# Altium schematic sheet Sheet2.SchDoc
size A4; SheetNumber: 2; SheetTotal: 2
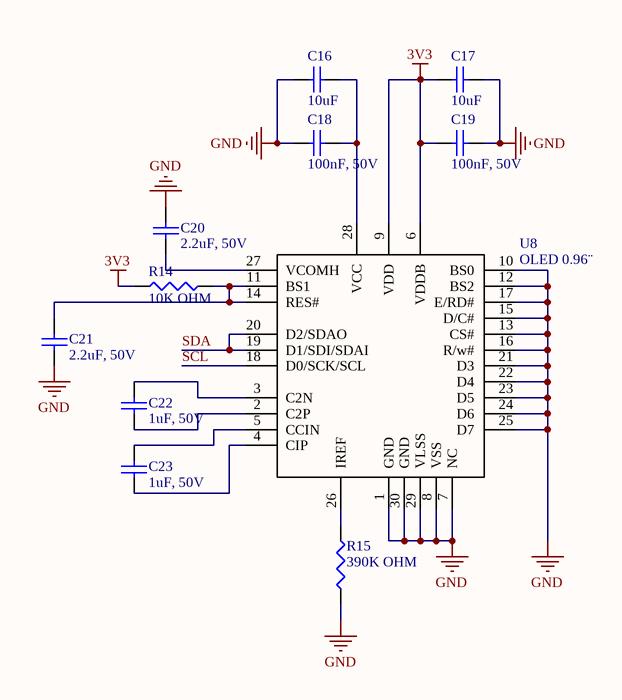
[diagram p0: Sheet2.SchDoc]

## Parts
C16  10uF  [CAP0805]
C17  10uF  [CAP0805]
C18  100nF, 50V  [CAP0805]
C19  100nF, 50V  [CAP0805]
C20  2.2uF, 50V  [CAP0805]
C21  2.2uF, 50V  [CAP0805]
C22  1uF, 50V  [CAP0805]
C23  1uF, 50V  [CAP0805]
R14  10K OHM  [RES 0805]
R15  390K OHM  [RES 0805]
U8  OLED 0.96¨  [OLED_0.96IN_WHITE_SSD1306]

## Nets
3V3: C17.1 C19.1 R14.1 U8.6(VDDB) U8.9(VDD)
GND: C16.1 C17.2 C18.1 C19.2 C20.2 C21.2 R15.2 U8.1(GND) U8.7(NC) U8.8(VSS) U8.10(BS0) U8.12(BS2) U8.13(CS#) U8.15(D/C#) U8.16(R/w#) U8.17(E/RD#) U8.21(D3) U8.22(D4) U8.23(D5) U8.24(D6) U8.25(D7) U8.29(VLSS) U8.30(GND)
SCL: U8.18(D0/SCK/SCL)
SDA: U8.19(D1/SDI/SDAI) U8.20(D2/SDAO)
NetC16_2: C16.2 C18.2 U8.28(VCC)
NetC20_1: C20.1 U8.27(VCOMH)
NetC21_1: C21.1 R14.2 U8.11(BS1) U8.14(RES#)
NetC22_1: C22.1 U8.2(C2P)
NetC22_2: C22.2 U8.3(C2N)
NetC23_1: C23.1 U8.4(CIP)
NetC23_2: C23.2 U8.5(CCIN)
NetR15_1: R15.1 U8.26(IREF)

## Library data of the parts
C16 C17 = C0805_10UF: CAP CER 10UF 0805; Manufacturer: Samsung Electro-Mechanics; Manufacturer Part Number: CL05B104KB5NNNC; Dielectric: X7R; Dielectric Material: Ceramic; Tolerance: 10%; Voltage Rating: 50V; Supplier: DigiKey; Supplier Part Number: 1276-CL05B104KB5NNNCCT-ND; RoHS: Compliant; Category: Ceramic Capacitors; Stock: 1751769; Pricing: 1=0,08, 10=0,008 (USD); Value: 10uF; Case/Package: 0402; China RoHS: Compliant; Country of Origin: Mainland China, Philippines, South Korea; Export Control Classification Number (ECCN) Code: EAR99; Height: 550µm; Harmonized Tariff Schedule (HTS) Code: 8532.24.00.20; Introduction Date: 2017-07-04; Lifecycle Status: Production; Material: Ceramic; Max Operating Temperature: 125°C; Min Operating Temperature: -55°C; Mounting Technology: Surface Mount; Number of Terminals: 2; REACH SVHC: Yes; Voltage Rating (DC): 50V; ComponentLink1URL: https://datasheet.octopart.com:443/CL05B104KB5NNNC-Samsung-Electro-Mechanics-datasheet-141346860.pdf?src-supplier=IHS; ComponentLink1Description: https://datasheet.octopart.com:443/CL05B104KB5NNNC-Samsung-Electro-Mechanics-datasheet-141346860.pdf?src-supplier=IHS; ComponentLink2URL: https://datasheet.octopart.com:443/CL05B104KB5NNNC-Samsung-datasheet-97040617.pdf?src-supplier=Future+Electronics; ComponentLink2Description: https://datasheet.octopart.com:443/CL05B104KB5NNNC-Samsung-datasheet-97040617.pdf?src-supplier=Future+Electronics; ComponentLink3URL: https://datasheet.octopart.com:443/CL05B104KB5NNNC-Samsung-datasheet-8326407.pdf?src-supplier=TME; ComponentLink3Description: https://datasheet.octopart.com:443/CL05B104KB5NNNC-Samsung-datasheet-8326407.pdf?src-supplier=TME; Part Number: CL05B104KB5NNNC; LCSC Part Number: C960916
C18 C19 = C0805 100nF: CAP CER 0.1UF 0805; Manufacturer: Samsung Electro-Mechanics; Manufacturer Part Number: CL05B104KB5NNNC; Dielectric: X7R; Dielectric Material: Ceramic; Tolerance: 10%; Supplier: DigiKey; Supplier Part Number: 1276-CL05B104KB5NNNCCT-ND; RoHS: Compliant; Category: Ceramic Capacitors; Stock: 1751769; Pricing: 1=0,08, 10=0,008 (USD); Value: 100nF; Case/Package: 0402; China RoHS: Compliant; Country of Origin: Mainland China, Philippines, South Korea; Export Control Classification Number (ECCN) Code: EAR99; Height: 550µm; Harmonized Tariff Schedule (HTS) Code: 8532.24.00.20; Introduction Date: 2017-07-04; Lifecycle Status: Production; Material: Ceramic; Max Operating Temperature: 125°C; Min Operating Temperature: -55°C; Mounting Technology: Surface Mount; Number of Terminals: 2; REACH SVHC: Yes; Voltage Rating: 50V; Voltage Rating (DC): 50V; ComponentLink1URL: https://datasheet.octopart.com:443/CL05B104KB5NNNC-Samsung-Electro-Mechanics-datasheet-141346860.pdf?src-supplier=IHS; ComponentLink1Description: https://datasheet.octopart.com:443/CL05B104KB5NNNC-Samsung-Electro-Mechanics-datasheet-141346860.pdf?src-supplier=IHS; ComponentLink2URL: https://datasheet.octopart.com:443/CL05B104KB5NNNC-Samsung-datasheet-97040617.pdf?src-supplier=Future+Electronics; ComponentLink2Description: https://datasheet.octopart.com:443/CL05B104KB5NNNC-Samsung-datasheet-97040617.pdf?src-supplier=Future+Electronics; ComponentLink3URL: https://datasheet.octopart.com:443/CL05B104KB5NNNC-Samsung-datasheet-8326407.pdf?src-supplier=TME; ComponentLink3Description: https://datasheet.octopart.com:443/CL05B104KB5NNNC-Samsung-datasheet-8326407.pdf?src-supplier=TME; Part Number: CL05B104KB5NNNC; LCSC Part Number: C960916
C20 C21 = C0805 2.2uF: CAP CER 2.2UF 0805; Manufacturer: Samsung Electro-Mechanics; Manufacturer Part Number: CL05B104KB5NNNC; Dielectric: X7R; Dielectric Material: Ceramic; Tolerance: 10%; Supplier: DigiKey; Supplier Part Number: 1276-CL05B104KB5NNNCCT-ND; RoHS: Compliant; Category: Ceramic Capacitors; Stock: 1751769; Pricing: 1=0,08, 10=0,008 (USD); Value: 2.2uF; Case/Package: 0402; China RoHS: Compliant; Country of Origin: Mainland China, Philippines, South Korea; Export Control Classification Number (ECCN) Code: EAR99; Height: 550µm; Harmonized Tariff Schedule (HTS) Code: 8532.24.00.20; Introduction Date: 2017-07-04; Lifecycle Status: Production; Material: Ceramic; Max Operating Temperature: 125°C; Min Operating Temperature: -55°C; Mounting Technology: Surface Mount; Number of Terminals: 2; REACH SVHC: Yes; Voltage Rating: 50V; Voltage Rating (DC): 50V; ComponentLink1URL: https://datasheet.octopart.com:443/CL05B104KB5NNNC-Samsung-Electro-Mechanics-datasheet-141346860.pdf?src-supplier=IHS; ComponentLink1Description: https://datasheet.octopart.com:443/CL05B104KB5NNNC-Samsung-Electro-Mechanics-datasheet-141346860.pdf?src-supplier=IHS; ComponentLink2URL: https://datasheet.octopart.com:443/CL05B104KB5NNNC-Samsung-datasheet-97040617.pdf?src-supplier=Future+Electronics; ComponentLink2Description: https://datasheet.octopart.com:443/CL05B104KB5NNNC-Samsung-datasheet-97040617.pdf?src-supplier=Future+Electronics; ComponentLink3URL: https://datasheet.octopart.com:443/CL05B104KB5NNNC-Samsung-datasheet-8326407.pdf?src-supplier=TME; ComponentLink3Description: https://datasheet.octopart.com:443/CL05B104KB5NNNC-Samsung-datasheet-8326407.pdf?src-supplier=TME; Part Number: CL05B104KB5NNNC; LCSC Part Number: C960916
C22 C23 = C0805 1uF: CAP CER 1UF 0805; Manufacturer: Samsung Electro-Mechanics; Manufacturer Part Number: CL05B104KB5NNNC; Dielectric: X7R; Dielectric Material: Ceramic; Tolerance: 10%; Supplier: DigiKey; Supplier Part Number: 1276-CL05B104KB5NNNCCT-ND; RoHS: Compliant; Category: Ceramic Capacitors; Stock: 1751769; Pricing: 1=0,08, 10=0,008 (USD); Value: 1uF; Case/Package: 0402; China RoHS: Compliant; Country of Origin: Mainland China, Philippines, South Korea; Export Control Classification Number (ECCN) Code: EAR99; Height: 550µm; Harmonized Tariff Schedule (HTS) Code: 8532.24.00.20; Introduction Date: 2017-07-04; Lifecycle Status: Production; Material: Ceramic; Max Operating Temperature: 125°C; Min Operating Temperature: -55°C; Mounting Technology: Surface Mount; Number of Terminals: 2; REACH SVHC: Yes; Voltage Rating: 50V; Voltage Rating (DC): 50V; ComponentLink1URL: https://datasheet.octopart.com:443/CL05B104KB5NNNC-Samsung-Electro-Mechanics-datasheet-141346860.pdf?src-supplier=IHS; ComponentLink1Description: https://datasheet.octopart.com:443/CL05B104KB5NNNC-Samsung-Electro-Mechanics-datasheet-141346860.pdf?src-supplier=IHS; ComponentLink2URL: https://datasheet.octopart.com:443/CL05B104KB5NNNC-Samsung-datasheet-97040617.pdf?src-supplier=Future+Electronics; ComponentLink2Description: https://datasheet.octopart.com:443/CL05B104KB5NNNC-Samsung-datasheet-97040617.pdf?src-supplier=Future+Electronics; ComponentLink3URL: https://datasheet.octopart.com:443/CL05B104KB5NNNC-Samsung-datasheet-8326407.pdf?src-supplier=TME; ComponentLink3Description: https://datasheet.octopart.com:443/CL05B104KB5NNNC-Samsung-datasheet-8326407.pdf?src-supplier=TME; Part Number: CL05B104KB5NNNC; LCSC Part Number: C960916
R14 = RES 10K OHM: RES 10K OHM 1% 1/16W 0805; Manufacturer: Yageo Group; Manufacturer Part Number: RC0402FR-074K7L; Power Dissipation: 62.5mW; Power Rating: 63mW; Value: 10kΩ; Temperature Coefficient: 100ppm/°C; Voltage Rating: 50V; Supplier: DigiKey; Supplier Part Number: 311-4.7KLRCT-ND; RoHS: Compliant; Category: Chip SMD Resistors; Stock: 5836618; Pricing: 1=0,1, 10=0,007, 25=0,006, 50=0,005, 100=0,0046, 250=0,00328 (USD); Case/Package: 0805; Case Code (Imperial): 0805; Case Code (Metric): 1005; China RoHS: Non-Compliant; Composition: Thick Film; Country of Origin: Mainland China, Taiwan; Depth: 500µm; Export Control Classification Number (ECCN) Code: EAR99; Height: 350µm; Harmonized Tariff Schedule (HTS) Code: 8533.21.00.30; Introduction Date: 2008-07-18; Lead Free: Lead Free; Length: 1mm; Lifecycle Status: Production; Max Operating Temperature: 155°C; Military Standard: Not; Min Operating Temperature: -55°C; Mounting Technology: Surface Mount; Pins: 2; Number of Terminals: 2; Packaging: Tape & Reel; REACH SVHC: Yes; Schedule B: 8533210045, 8533210045|8533210045, 8533210045|8533210045|8533210045, 8533210045|8533210045|8533210045|8533210045; Termination: SMD/SMT; Tolerance: 1%; Voltage Rating (AC): 50V; Voltage Rating (DC): 50V; Width: 500µm; Working Voltage: 50V; ComponentLink1URL: https://datasheet.octopart.com:443/RC0402FR-074K7L-Yageo-datasheet-175887523.pdf?src-supplier=IHS; ComponentLink1Description: https://datasheet.octopart.com:443/RC0402FR-074K7L-Yageo-datasheet-175887523.pdf?src-supplier=IHS; ComponentLink2URL: https://datasheet.octopart.com:443/RC0402FR-074K7L-Yageo-datasheet-103092701.pdf?src-supplier=Upverter; ComponentLink2Description: https://datasheet.octopart.com:443/RC0402FR-074K7L-Yageo-datasheet-103092701.pdf?src-supplier=Upverter; ComponentLink3URL: https://datasheet.octopart.com:443/RC0402FR-074K7L-Yageo-datasheet-98239111.pdf?src-supplier=Upverter; ComponentLink3Description: https://datasheet.octopart.com:443/RC0402FR-074K7L-Yageo-datasheet-98239111.pdf?src-supplier=Upverter; ComponentLink4URL: https://datasheet.octopart.com:443/RC0402FR-074K7L-Yageo-Group-datasheet-190305687.pdf?src-supplier=Future+Electronics; ComponentLink4Description: https://datasheet.octopart.com:443/RC0402FR-074K7L-Yageo-Group-datasheet-190305687.pdf?src-supplier=Future+Electronics; ComponentLink5URL: https://datasheet.octopart.com:443/RC0402FR-074K7L-Yageo-datasheet-164759695.pdf?src-supplier=Future+Electronics; ComponentLink5Description: https://datasheet.octopart.com:443/RC0402FR-074K7L-Yageo-datasheet-164759695.pdf?src-supplier=Future+Electronics; ComponentLink6URL: https://datasheet.octopart.com:443/RC0402FR-074K7L-Yageo-datasheet-137700087.pdf?src-supplier=Future+Electronics; ComponentLink6Description: https://datasheet.octopart.com:443/RC0402FR-074K7L-Yageo-datasheet-137700087.pdf?src-supplier=Future+Electronics; ComponentLink7URL: https://datasheet.octopart.com:443/RC0402FR-074K7L-Yageo-Group-datasheet-190051977.pdf?src-supplier=Newark; ComponentLink7Description: https://datasheet.octopart.com:443/RC0402FR-074K7L-Yageo-Group-datasheet-190051977.pdf?src-supplier=Newark; ComponentLink8URL: https://datasheet.octopart.com:443/RC0402FR-074K7L-Yageo-datasheet-12531192.pdf?src-supplier=Newark; ComponentLink8Description: https://datasheet.octopart.com:443/RC0402FR-074K7L-Yageo-datasheet-12531192.pdf?src-supplier=Newark; ComponentLink9URL: https://datasheet.octopart.com:443/RC0402FR-074K7L-Yageo-datasheet-8324527.pdf?src-supplier=Newark; ComponentLink9Description: https://datasheet.octopart.com:443/RC0402FR-074K7L-Yageo-datasheet-8324527.pdf?src-supplier=Newark; ComponentLink10URL: https://datasheet.octopart.com:443/RC0402FR-074K7L-Yageo-datasheet-10408619.pdf?src-supplier=element14+APAC; ComponentLink10Description: https://datasheet.octopart.com:443/RC0402FR-074K7L-Yageo-datasheet-10408619.pdf?src-supplier=element14+APAC; ComponentLink11URL: https://datasheet.octopart.com:443/RC0402FR-074K7L-Yageo-datasheet-13691069.pdf?src-supplier=element14+APAC; ComponentLink11Description: https://datasheet.octopart.com:443/RC0402FR-074K7L-Yageo-datasheet-13691069.pdf?src-supplier=element14+APAC; ComponentLink12URL: https://datasheet.octopart.com:443/RC0402FR-074K7L-Yageo-datasheet-62067350.pdf?src-supplier=Farnell; ComponentLink12Description: https://datasheet.octopart.com:443/RC0402FR-074K7L-Yageo-datasheet-62067350.pdf?src-supplier=Farnell; ComponentLink13URL: https://datasheet.octopart.com:443/RC0402FR-074K7L-Yageo-datasheet-8329306.pdf?src-supplier=element14; ComponentLink13Description: https://datasheet.octopart.com:443/RC0402FR-074K7L-Yageo-datasheet-8329306.pdf?src-supplier=element14; ComponentLink14URL: https://datasheet.octopart.com:443/RC0402FR-074K7L-Yageo-datasheet-175423674.pdf?src-supplier=SOS+electronic; ComponentLink14Description: https://datasheet.octopart.com:443/RC0402FR-074K7L-Yageo-datasheet-175423674.pdf?src-supplier=SOS+electronic; ComponentLink15URL: https://datasheet.octopart.com:443/RC0402FR-074K7L-Yageo-datasheet-79472498.pdf?src-supplier=Megastar; ComponentLink15Description: https://datasheet.octopart.com:443/RC0402FR-074K7L-Yageo-datasheet-79472498.pdf?src-supplier=Megastar; ComponentLink16URL: https://datasheet.octopart.com/RC0402FR-074K7L-Yageo-datasheet-73766026.pdf; ComponentLink16Description: https://datasheet.octopart.com/RC0402FR-074K7L-Yageo-datasheet-73766026.pdf; ComponentLink17URL: http://sigma.octopart.com:80/conflict_mineral_statement/Yageo-company-3.pdf?src-supplier=Compliance+Statements; ComponentLink17Description: http://sigma.octopart.com:80/conflict_mineral_statement/Yageo-company-3.pdf?src-supplier=Compliance+Statements; ComponentLink18URL: http://sigma.octopart.com:80/rohs_statement/Yageo-company-2.pdf?src-supplier=Compliance+Statements; ComponentLink18Description: http://sigma.octopart.com:80/rohs_statement/Yageo-company-2.pdf?src-supplier=Compliance+Statements; LCSC Part Number: C105871
R15 = RES 0805 390K OHM_1: RES 390K OHM 1% 1/16W 0805; Manufacturer: Yageo Group; Manufacturer Part Number: RC0402FR-074K7L; Power Dissipation: 62.5mW; Power Rating: 63mW; Value: 1kΩ; Temperature Coefficient: 100ppm/°C; Voltage Rating: 50V; Supplier: DigiKey; Supplier Part Number: 311-4.7KLRCT-ND; RoHS: Compliant; Category: Chip SMD Resistors; Stock: 5836618; Pricing: 1=0,1, 10=0,007, 25=0,006, 50=0,005, 100=0,0046, 250=0,00328 (USD); Case/Package: 0805; Case Code (Imperial): 0805; Case Code (Metric): 1005; China RoHS: Non-Compliant; Composition: Thick Film; Country of Origin: Mainland China, Taiwan; Depth: 500µm; Export Control Classification Number (ECCN) Code: EAR99; Height: 350µm; Harmonized Tariff Schedule (HTS) Code: 8533.21.00.30; Introduction Date: 2008-07-18; Lead Free: Lead Free; Length: 1mm; Lifecycle Status: Production; Max Operating Temperature: 155°C; Military Standard: Not; Min Operating Temperature: -55°C; Mounting Technology: Surface Mount; Pins: 2; Number of Terminals: 2; Packaging: Tape & Reel; REACH SVHC: Yes; Schedule B: 8533210045, 8533210045|8533210045, 8533210045|8533210045|8533210045, 8533210045|8533210045|8533210045|8533210045; Termination: SMD/SMT; Tolerance: 1%; Voltage Rating (AC): 50V; Voltage Rating (DC): 50V; Width: 500µm; Working Voltage: 50V; ComponentLink1URL: https://datasheet.octopart.com:443/RC0402FR-074K7L-Yageo-datasheet-175887523.pdf?src-supplier=IHS; ComponentLink1Description: https://datasheet.octopart.com:443/RC0402FR-074K7L-Yageo-datasheet-175887523.pdf?src-supplier=IHS; ComponentLink2URL: https://datasheet.octopart.com:443/RC0402FR-074K7L-Yageo-datasheet-103092701.pdf?src-supplier=Upverter; ComponentLink2Description: https://datasheet.octopart.com:443/RC0402FR-074K7L-Yageo-datasheet-103092701.pdf?src-supplier=Upverter; ComponentLink3URL: https://datasheet.octopart.com:443/RC0402FR-074K7L-Yageo-datasheet-98239111.pdf?src-supplier=Upverter; ComponentLink3Description: https://datasheet.octopart.com:443/RC0402FR-074K7L-Yageo-datasheet-98239111.pdf?src-supplier=Upverter; ComponentLink4URL: https://datasheet.octopart.com:443/RC0402FR-074K7L-Yageo-Group-datasheet-190305687.pdf?src-supplier=Future+Electronics; ComponentLink4Description: https://datasheet.octopart.com:443/RC0402FR-074K7L-Yageo-Group-datasheet-190305687.pdf?src-supplier=Future+Electronics; ComponentLink5URL: https://datasheet.octopart.com:443/RC0402FR-074K7L-Yageo-datasheet-164759695.pdf?src-supplier=Future+Electronics; ComponentLink5Description: https://datasheet.octopart.com:443/RC0402FR-074K7L-Yageo-datasheet-164759695.pdf?src-supplier=Future+Electronics; ComponentLink6URL: https://datasheet.octopart.com:443/RC0402FR-074K7L-Yageo-datasheet-137700087.pdf?src-supplier=Future+Electronics; ComponentLink6Description: https://datasheet.octopart.com:443/RC0402FR-074K7L-Yageo-datasheet-137700087.pdf?src-supplier=Future+Electronics; ComponentLink7URL: https://datasheet.octopart.com:443/RC0402FR-074K7L-Yageo-Group-datasheet-190051977.pdf?src-supplier=Newark; ComponentLink7Description: https://datasheet.octopart.com:443/RC0402FR-074K7L-Yageo-Group-datasheet-190051977.pdf?src-supplier=Newark; ComponentLink8URL: https://datasheet.octopart.com:443/RC0402FR-074K7L-Yageo-datasheet-12531192.pdf?src-supplier=Newark; ComponentLink8Description: https://datasheet.octopart.com:443/RC0402FR-074K7L-Yageo-datasheet-12531192.pdf?src-supplier=Newark; ComponentLink9URL: https://datasheet.octopart.com:443/RC0402FR-074K7L-Yageo-datasheet-8324527.pdf?src-supplier=Newark; ComponentLink9Description: https://datasheet.octopart.com:443/RC0402FR-074K7L-Yageo-datasheet-8324527.pdf?src-supplier=Newark; ComponentLink10URL: https://datasheet.octopart.com:443/RC0402FR-074K7L-Yageo-datasheet-10408619.pdf?src-supplier=element14+APAC; ComponentLink10Description: https://datasheet.octopart.com:443/RC0402FR-074K7L-Yageo-datasheet-10408619.pdf?src-supplier=element14+APAC; ComponentLink11URL: https://datasheet.octopart.com:443/RC0402FR-074K7L-Yageo-datasheet-13691069.pdf?src-supplier=element14+APAC; ComponentLink11Description: https://datasheet.octopart.com:443/RC0402FR-074K7L-Yageo-datasheet-13691069.pdf?src-supplier=element14+APAC; ComponentLink12URL: https://datasheet.octopart.com:443/RC0402FR-074K7L-Yageo-datasheet-62067350.pdf?src-supplier=Farnell; ComponentLink12Description: https://datasheet.octopart.com:443/RC0402FR-074K7L-Yageo-datasheet-62067350.pdf?src-supplier=Farnell; ComponentLink13URL: https://datasheet.octopart.com:443/RC0402FR-074K7L-Yageo-datasheet-8329306.pdf?src-supplier=element14; ComponentLink13Description: https://datasheet.octopart.com:443/RC0402FR-074K7L-Yageo-datasheet-8329306.pdf?src-supplier=element14; ComponentLink14URL: https://datasheet.octopart.com:443/RC0402FR-074K7L-Yageo-datasheet-175423674.pdf?src-supplier=SOS+electronic; ComponentLink14Description: https://datasheet.octopart.com:443/RC0402FR-074K7L-Yageo-datasheet-175423674.pdf?src-supplier=SOS+electronic; ComponentLink15URL: https://datasheet.octopart.com:443/RC0402FR-074K7L-Yageo-datasheet-79472498.pdf?src-supplier=Megastar; ComponentLink15Description: https://datasheet.octopart.com:443/RC0402FR-074K7L-Yageo-datasheet-79472498.pdf?src-supplier=Megastar; ComponentLink16URL: https://datasheet.octopart.com/RC0402FR-074K7L-Yageo-datasheet-73766026.pdf; ComponentLink16Description: https://datasheet.octopart.com/RC0402FR-074K7L-Yageo-datasheet-73766026.pdf; ComponentLink17URL: http://sigma.octopart.com:80/conflict_mineral_statement/Yageo-company-3.pdf?src-supplier=Compliance+Statements; ComponentLink17Description: http://sigma.octopart.com:80/conflict_mineral_statement/Yageo-company-3.pdf?src-supplier=Compliance+Statements; ComponentLink18URL: http://sigma.octopart.com:80/rohs_statement/Yageo-company-2.pdf?src-supplier=Compliance+Statements; ComponentLink18Description: http://sigma.octopart.com:80/rohs_statement/Yageo-company-2.pdf?src-supplier=Compliance+Statements; LCSC Part Number: C105871
U8 = OLED 0.96¨: By Prince